# Altium schematic sheet MANOPOLATORE_2040_ZERO.SchDoc
size A4; SheetNumber: 1; SheetTotal: 5
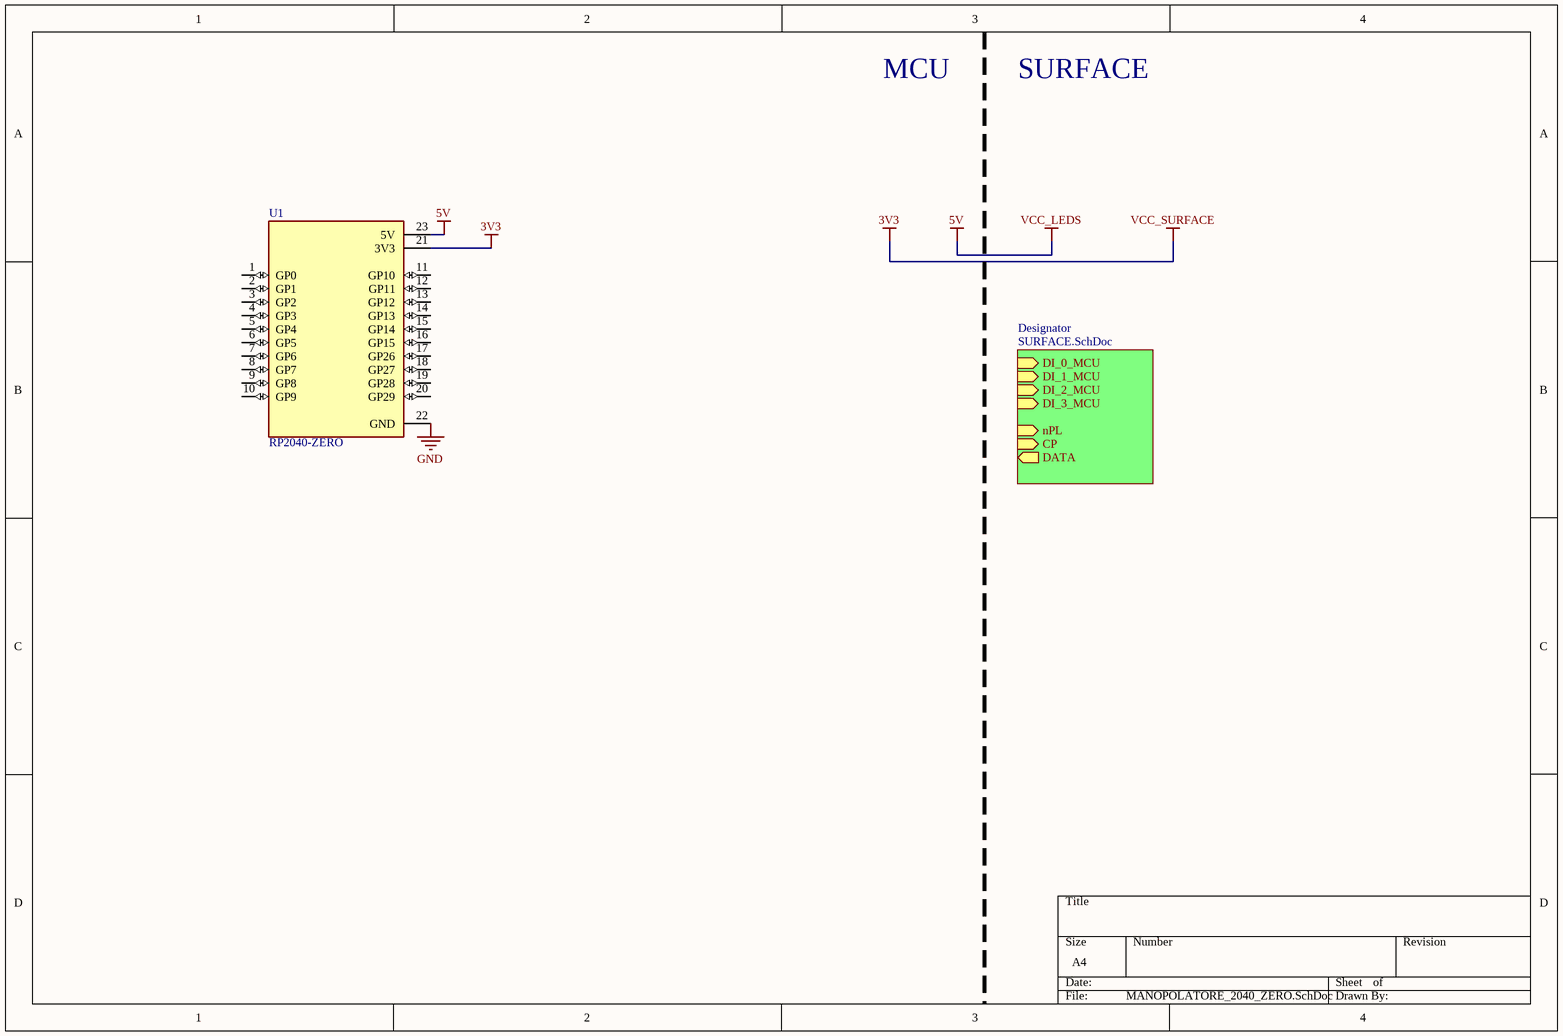
[diagram p0: MANOPOLATORE_2040_ZERO.SchDoc]

## Parts
U1  RP2040-ZERO  [MODULE_RP2040-ZERO]

## Sub-sheets
Designator = SURFACE.SchDoc: DI_0_MCU (in), DI_1_MCU (in), DI_2_MCU (in), DI_3_MCU (in), nPL (in), CP (in), DATA (out)

## Nets
3V3: U1.21(3V3)  [also labelled VCC_SURFACE]
5V: U1.23(5V)  [also labelled VCC_LEDS]
GND: U1.22(GND)

Not connected (* = marked no-connect by the designer): U1 1(GP0) 2(GP1) 3(GP2) 4(GP3) 5(GP4) 6(GP5) 7(GP6) 8(GP7) 9(GP8) 10(GP9) 11(GP10) 12(GP11) 13(GP12) 14(GP13) 15(GP14) 16(GP15) 17(GP26) 18(GP27) 19(GP28) 20(GP29)

## Notes on the sheet
- MCU
- SURFACE

## Library data of the parts
U1 = RP2040-ZERO: Low-Cost, High-Performance Pico-Like MCU Board Based On Raspberry Pi Microcontroller RP2040; MF: Waveshare Electronics; SnapEDA_Link: https://www.snapeda.com/parts/RP2040-ZERO/Waveshare+Electronics/view-part/?ref=snap; Package: Package; Value: *; MP: RP2040-ZERO; Check_prices: https://www.snapeda.com/parts/RP2040-ZERO/Waveshare+Electronics/view-part/?ref=eda